# EAGLE design 237_temperature (EAGLE 9.2.2)
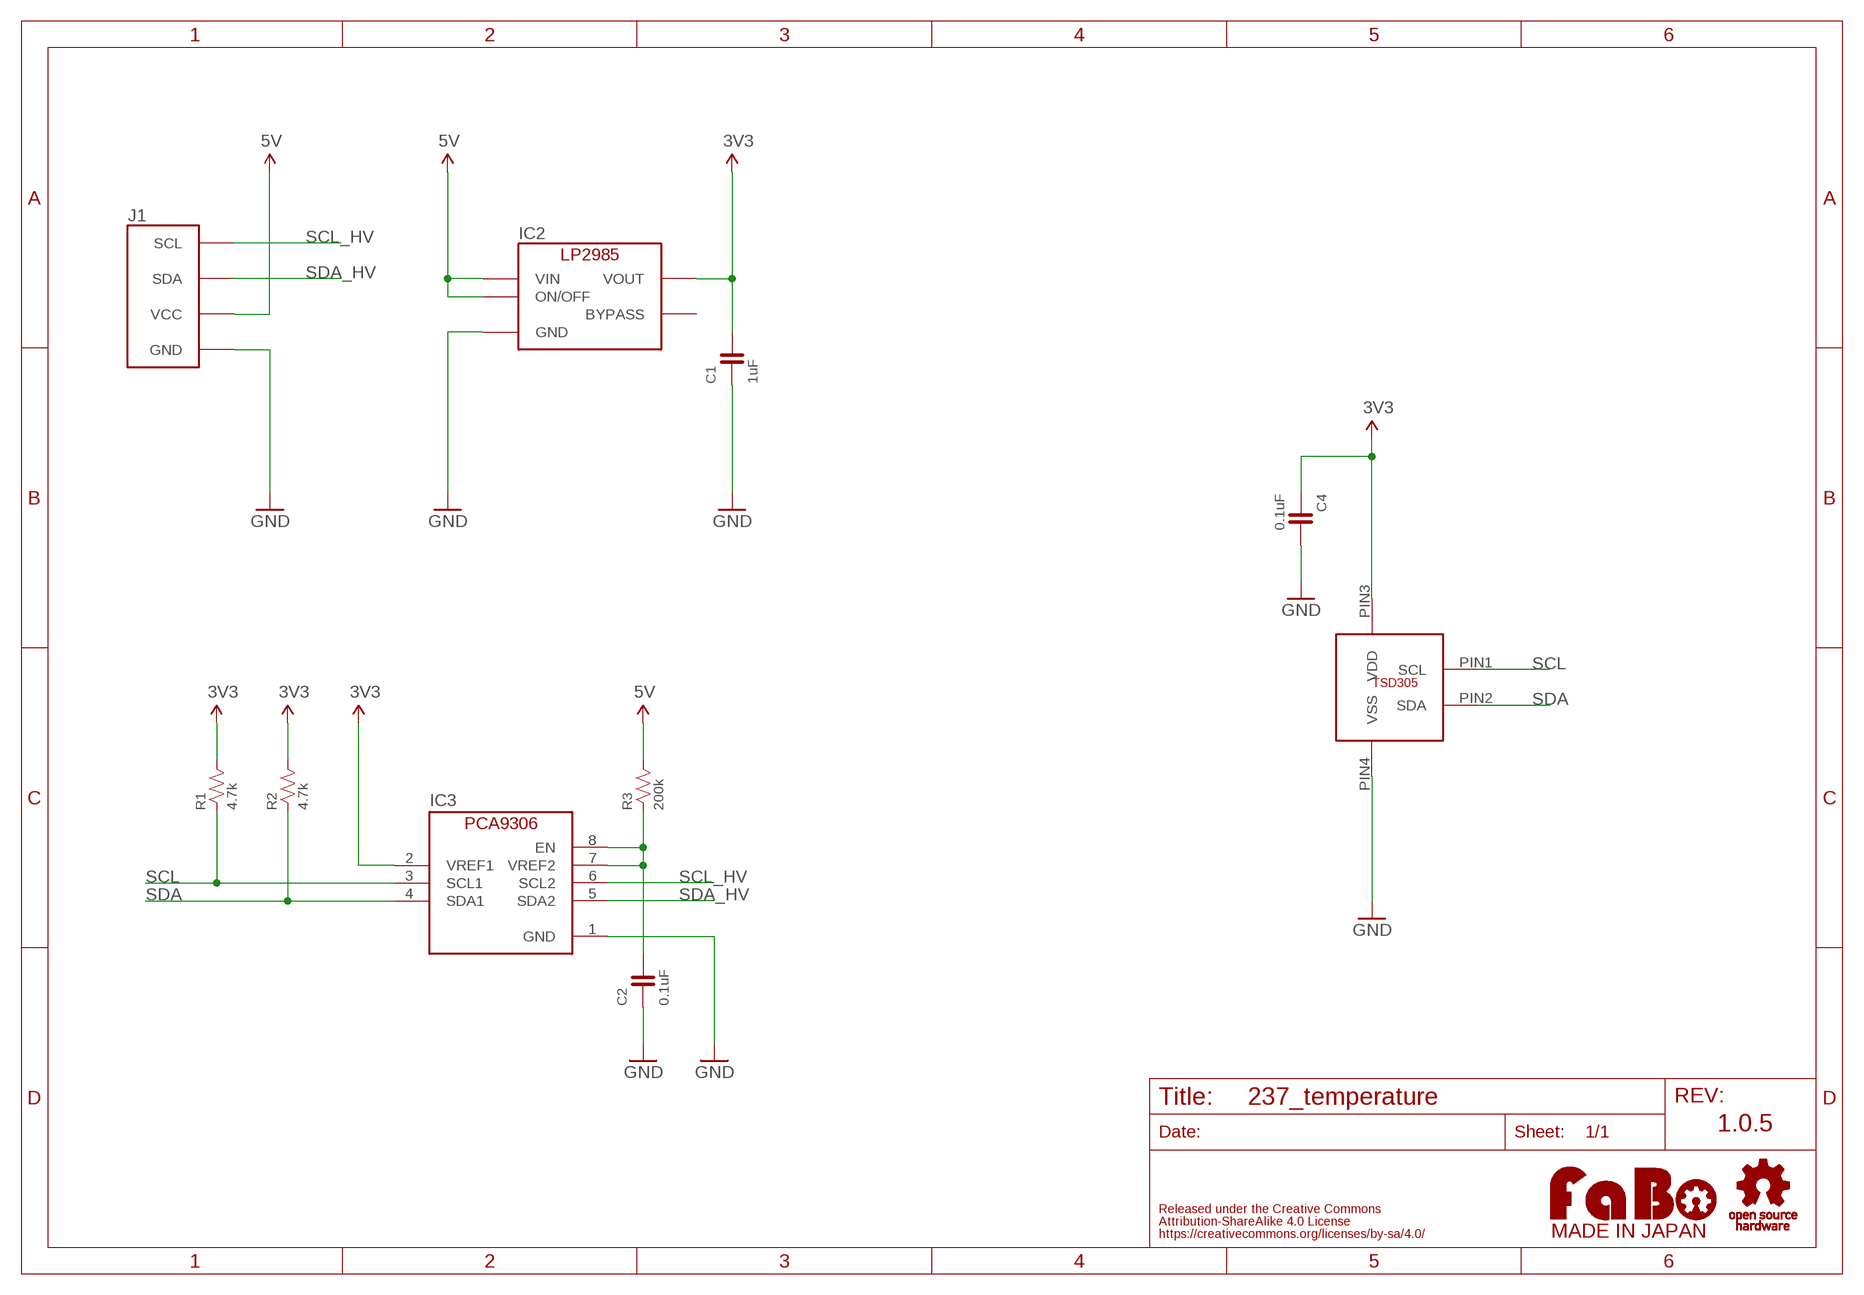
[diagram p0: schematic, sheet 1]

## Parts
C1  1uF  CAPACITOR-0603  [0603]
C2  0.1uF  CAPACITOR-0603  [0603]
C4  0.1uF  CAPACITOR-0603  [0603]
IC2  LP2985-33DBV  [SOT-23-5]
IC3  PCA9306GM  [XQFN8]
J1  FABO_BRICK_I2C  [FABO_BRICK_I2C]
R1  4.7k  RESISTOR-0603  [0603]
R2  4.7k  RESISTOR-0603  [0603]
R3  200k  RESISTOR-0603  [0603]
TSD305  TE-TSD305  [TE-TSD305]
U$2  LOGO_OSHW-M_BOTTOM  [LOGO_OSHW_M_BOTTOM]
U$3  LOGO_FABO-M  [LOGO_FABO_MS]

## Nets
3V3: C1.2 C4.1 IC2.5(VOUT) IC3.2(VREF1) R1.2 R2.2 TSD305.PIN3(VDD)
5V: IC2.1(VIN) IC2.3(ON/OFF) J1.VCC R3.2
GND: C1.1 C2.1 C4.2 IC2.2(GND) IC3.1(GND) J1.GND TSD305.PIN4(VSS)
N$1: C2.2 IC3.7(VREF2) IC3.8(EN) R3.1
SCL: IC3.3(SCL1) R1.1 TSD305.PIN1(SCL)
SCL_HV: IC3.6(SCL2) J1.SCL
SDA: IC3.4(SDA1) R2.1 TSD305.PIN2(SDA)
SDA_HV: IC3.5(SDA2) J1.SDA
Unconnected: IC2.4(BYPASS)

## Notes on the sheet
- 1.0.5

## Library data of the parts
C1 C2 C4 = FaBo-Capacitor:CAPACITOR: CAPACITOR
IC2 = FaBo-Supply:LP2985: LP2985
IC3 = FaBo-LevelTranslator:PCA9306
J1 = FaBo-Template:FABO_BRICK_I2C: FaBo Brick I2C
R1-R3 = FaBo-Resistors:RESISTOR: RESISTOR
TSD305 = FaBo-Environment:TE-TSD305
U$2 = FaBo-etc:LOGO_OSHW
U$3 = FaBo-etc:LOGO_FABO

## Board
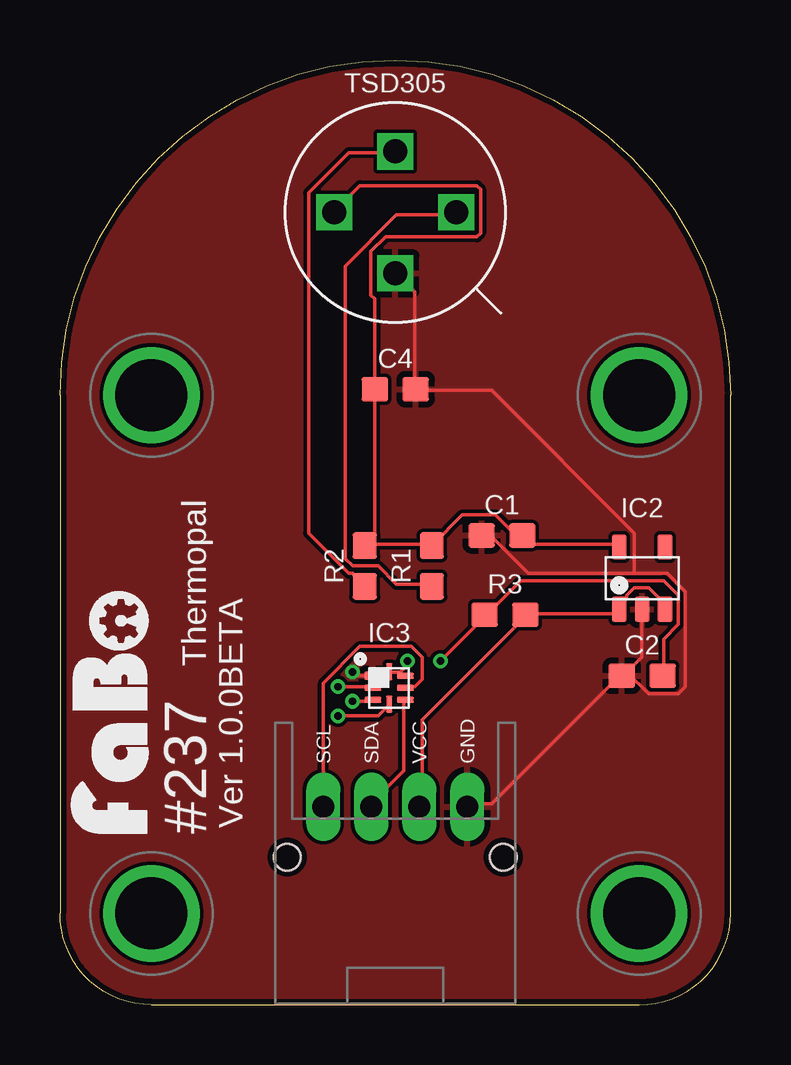
[diagram p1: board, top side]
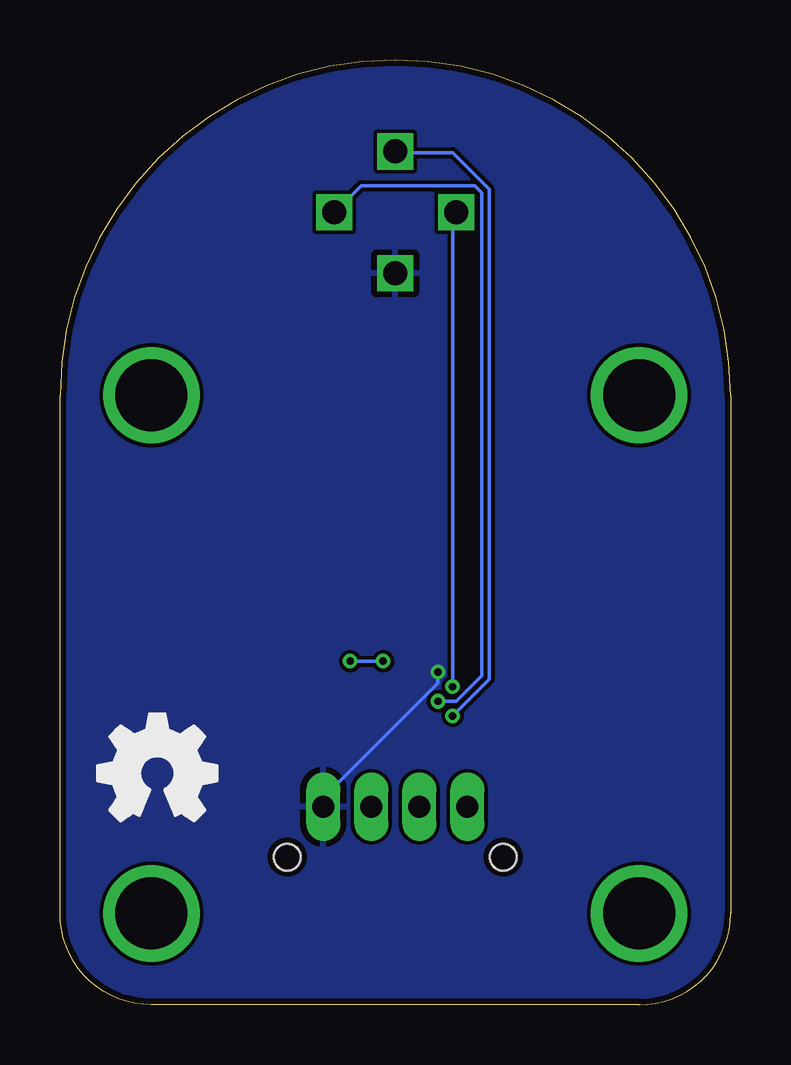
[diagram p2: board, bottom side, seen from below]

Size 27.94 x 39.37 mm. Coordinates in mm from the lower left corner, seen from the top.
Copper layers (1*16): Top 0.035mm / dielectric 1.5mm / Bottom 0.035mm
Design rules "SeeedStudio_2layer_DRU_no_angle_20140221": minimum track width 6mil, minimum drill 12mil, track to track 6mil, track to pad 6mil, pad to pad 6mil, via to via 6mil, smd to smd 0mil, copper to edge 10mil, drill to drill 10mil, minimum pad ring 10mil, minimum via ring 6mil, stop-mask expansion 2mil, vias tented up to drill 100mil, thermal gap 10mil

### Footprints (pad centres in the part's own frame; a part is rotated, then mirrored left to right if it is on the bottom)
0603 = smd 1.1 x 1: 1 -0.85,0; 2 0.85,0
SOT-23-5 = smd 0.6 x 1.05: 1 -0.95,-1.3; 2 0,-1.3; 3 0.95,-1.3; 4 0.95,1.3; 5 -0.95,1.3
XQFN8 = smd 0.7 x 0.35: 1 -0.675,0.5 | smd 0.7 x 0.25: 2 -0.675,0; 3 -0.675,-0.5; 5 0.675,-0.5; 6 0.675,0; 7 0.675,0.5 | smd 0.25 x 0.7: 4 0,-0.675; 8 0,0.675
FABO_BRICK_I2C = drill 0.9 pad 1.422 long: GND 3,-10.795; SCL -3,-10.795; SDA -1,-10.795; VCC 1,-10.795 | drill 3 pad 3.81: P$1 -10.16,6.35; P$2 10.16,6.35; P$3 -10.16,-15.24; P$4 10.16,-15.24 | hole 1.1: -4.5,-12.895; 4.5,-12.895
TE-TSD305 = drill 1 square: PIN1 2.54,0; PIN2 0,2.54; PIN3 -2.54,0; PIN4 0,-2.54

### Placement (x,y rotation side)
C1  18.41,19.56 0 top
C2  24.26,13.72 0 top
C4  13.97,25.65 0 top
IC2  24.26,17.78 0 top
IC3  13.72,13.21 0 top
J1  13.97,19.05 0 top
R1  15.49,18.29 90 top
R2  12.7,18.29 90 top
R3  18.54,16.26 0 top
TSD305  13.97,33.02 0 top
U$2  23.88,9.65 0 top
U$3  4.06,12.19 90 top

### Tracks (layer width: path | path; a pad name or v marks a point on that pad's centre or on a via)
3V3  (via drill 0.3)
  Top 0.152: IC2.5 23.16,19.2 19.66,19.2 19.36,19.51 C1.2 19.2,19.66 18.9,19.66 18.14,20.42 16.76,20.42 15.54,19.2 R1.2 15.39,19.2 13.11,19.2 | 13.11,19.2 12.8,19.2 R2.2 13.11,19.2 | 13.11,19.2 13.11,25.6 C4.1 13.11,25.76 13.11,29.41 12.95,29.57 12.95,31.39 13.56,32 17.37,32 17.53,32.16 17.53,33.98 17.37,34.14 12.5,34.14 11.43,33.07 TSD305.PIN3 | v11.58,13.26 12.95,13.26 IC3.2
  Bottom 0.152: v11.58,13.26 11.58,32.77 11.43,32.92 TSD305.PIN3
5V
  Top 0.152: IC2.3 25.3,16.61 24.54,17.37 23.93,17.37 23.62,17.07 23.62,16.92 23.32,16.61 IC2.1 23.16,16.46 23.01,16.31 19.51,16.31 R3.2 19.36,16.15 15.09,11.89 15.09,8.38 J1.VCC
GND  (via drill 0.3)
  Top 0.152: v12.19,13.87 12.34,13.72 12.95,13.72 IC3.1 | TSD305.PIN4 14.02,30.48 14.78,29.72 14.78,25.76 C4.2 14.94,25.6 17.98,25.6 23.93,19.66 23.93,17.98 | 23.62,13.87 23.47,13.72 C2.1 | 23.62,13.87 24.23,14.48 24.23,16.46 IC2.2 | 23.93,17.98 25.3,17.98 26.06,17.22 26.06,13.26 25.76,12.95 24.54,12.95 23.62,13.87 | 23.93,17.98 19.51,17.98 17.98,19.51 17.68,19.51 C1.1 | 23.62,13.87 C2.1 | J1.GND 17.07,8.38 17.98,8.38 23.32,13.72 C2.1
  Bottom 0.152: v12.19,13.87 12.19,13.41 16.92,8.69 16.92,8.38 J1.GND
  pour Bottom: 0,0 27.94,0 27.94,39.37 0,39.37 0,0.64
  pour Top: 0,0 27.94,0 27.94,39.37 0,39.37
N$1  (via drill 0.3)
  Top 0.152: 14.17,13.87 13.72,13.87 IC3.8 | 14.17,13.87 14.33,13.72 IC3.7 | 14.17,13.87 14.48,14.17 v14.48,14.33 | v15.85,14.33 17.68,16.15 R3.1 17.83,16.31 19.2,17.68 25.15,17.68 25.76,17.07 25.76,15.85 25.15,15.24 25.15,13.72 C2.2
  Bottom 0.152: v15.85,14.33 v14.48,14.33
SCL  (via drill 0.3)
  Top 0.152: v12.19,12.65 12.95,12.65 IC3.3 | R1.1 15.39,17.53 14.02,17.53 13.26,18.29 12.19,18.29 11.89,18.59 11.89,30.79 14.02,32.92 16.46,32.92 TSD305.PIN1
  Bottom 0.152: v12.19,12.65 11.43,12.65 10.36,13.72 10.36,33.83 10.67,34.14 15.39,34.14 TSD305.PIN1
SCL_HV
  Top 0.152: IC3.6 14.48,13.26 14.78,13.26 15.09,13.56 15.09,14.48 14.63,14.94 12.5,14.94 10.97,13.41 10.97,8.38 J1.SCL
SDA  (via drill 0.3)
  Top 0.152: v11.58,12.04 13.26,12.04 13.72,12.5 IC3.4 | R2.1 12.65,17.53 12.19,17.98 12.04,17.98 10.36,19.66 10.36,33.83 12.04,35.51 13.87,35.51 TSD305.PIN2
  Bottom 0.152: v11.58,12.04 10.06,13.56 10.06,33.98 11.58,35.51 13.87,35.51 TSD305.PIN2
SDA_HV
  Top 0.152: IC3.5 14.33,12.65 14.33,9.75 12.95,8.38 J1.SDA

### Text on the board
tPlace: Thermopal | #237 | Ver 1.0.0BETA